# EAGLE schematic Pendeluhr (EAGLE 5.06)
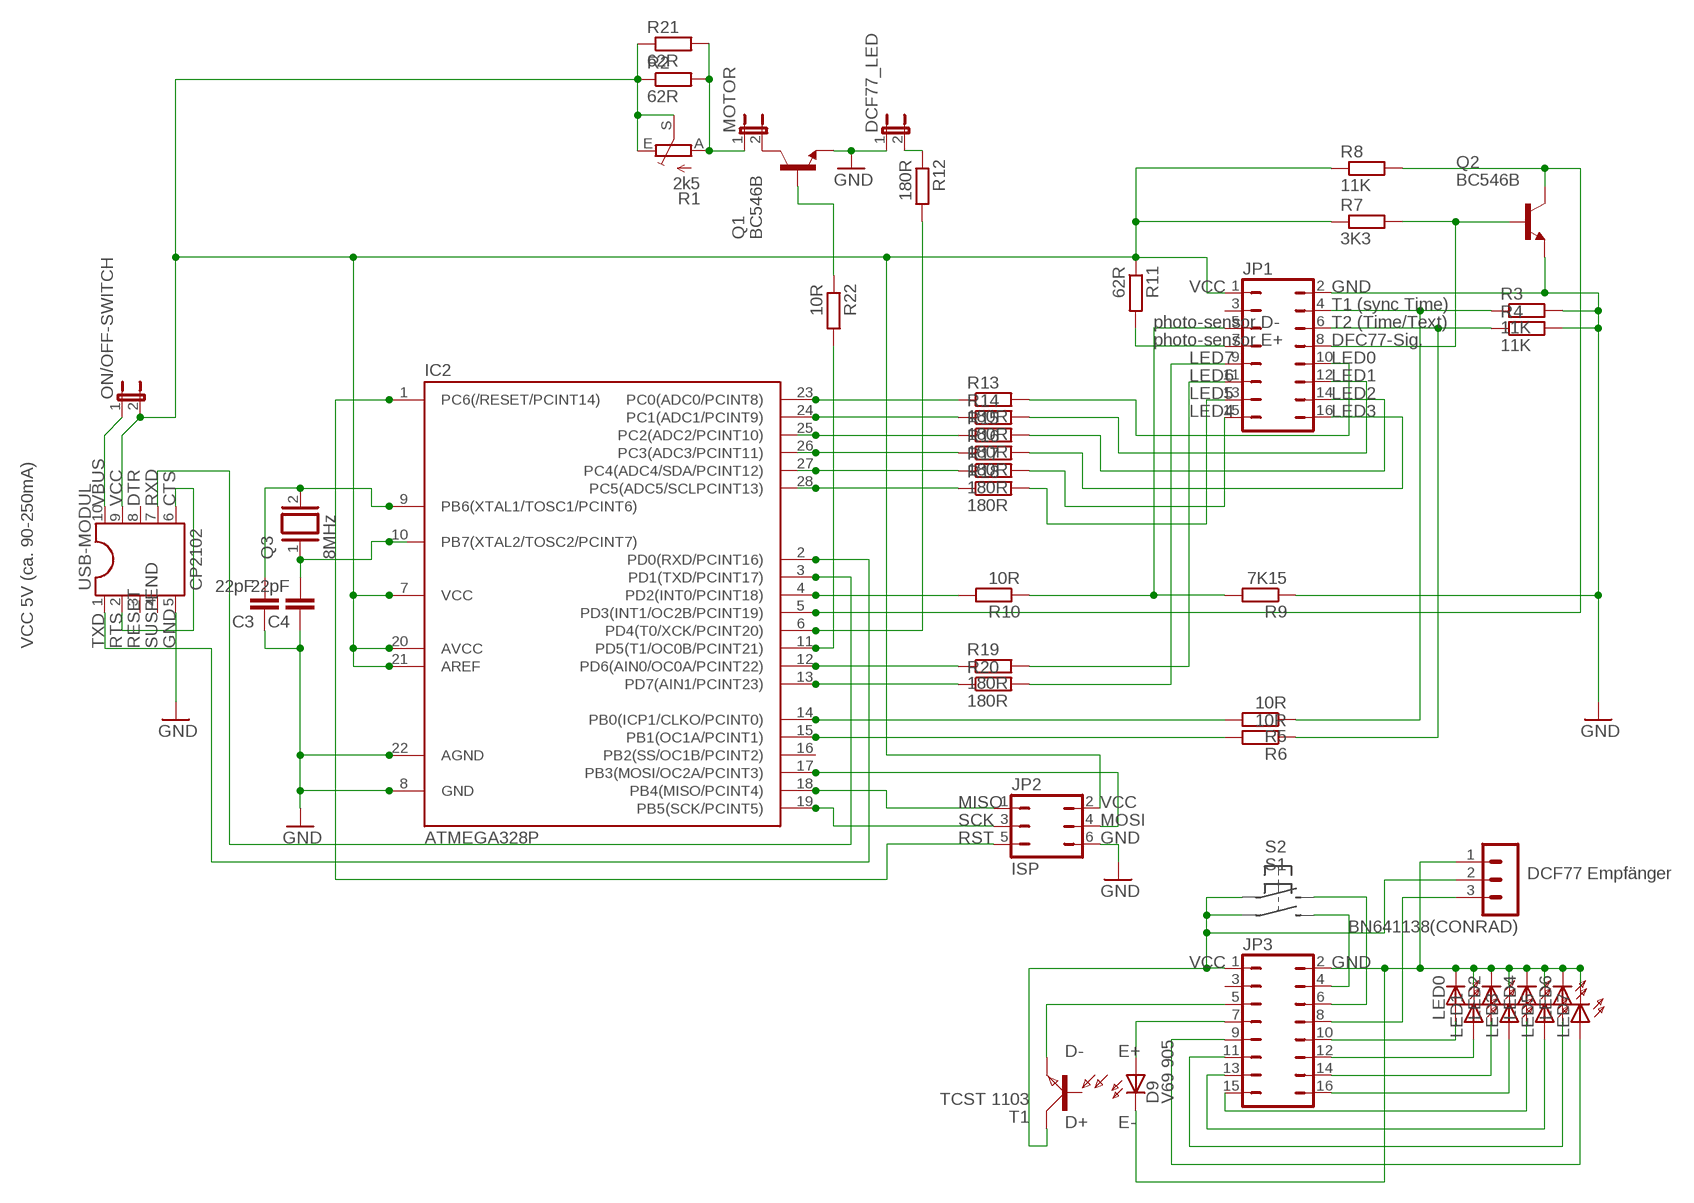
[diagram p0: schematic, sheet 1]

## Parts
BN641138(CONRAD)  MA03-1  [MA03-1]
C3  22pF  C-EU025-024X044  [C025-024X044]
C4  22pF  C-EU025-024X044  [C025-024X044]
D9  V69 905  HLMP6  [HLMP6]
DCF77_LED  JP1E  [JP1]
IC2  ATMEGA328P  MEGA48/88/168-PU  [DIL28-3]
JP1  JP8Q  [JP8Q]
JP2  ISP  JP3Q  [JP3Q]
JP3  JP8Q  [JP8Q]
LED0  HLMP6  [HLMP6]
LED1  HLMP6  [HLMP6]
LED2  HLMP6  [HLMP6]
LED3  HLMP6  [HLMP6]
LED4  HLMP6  [HLMP6]
LED5  HLMP6  [HLMP6]
LED6  HLMP6  [HLMP6]
LED7  HLMP6  [HLMP6]
MOTOR  JP1E  [JP1]
ON/OFF-SWITCH  JP1E  [JP1]
Q1  BC546B  [TO92-EBC]
Q2  BC546B  [TO92-EBC]
Q3  8MHz  XTAL/S  [QS]
R1  2k5  TRIM_EU-CA9V  [CA9V]
R2  62R  R-EU_0207/10  [0207/10]
R3  11K  R-EU_0207/10  [0207/10]
R4  11K  R-EU_0207/10  [0207/10]
R5  10R  R-EU_0207/10  [0207/10]
R6  10R  R-EU_0207/10  [0207/10]
R7  3K3  R-EU_0207/10  [0207/10]
R8  11K  R-EU_0207/10  [0207/10]
R9  7K15  R-EU_0207/10  [0207/10]
R10  10R  R-EU_0207/10  [0207/10]
R11  62R  R-EU_0207/10  [0207/10]
R12  180R  R-EU_0207/10  [0207/10]
R13  180R  R-EU_0207/10  [0207/10]
R14  180R  R-EU_0207/10  [0207/10]
R15  180R  R-EU_0207/10  [0207/10]
R16  180R  R-EU_0207/10  [0207/10]
R17  180R  R-EU_0207/10  [0207/10]
R18  180R  R-EU_0207/10  [0207/10]
R19  180R  R-EU_0207/10  [0207/10]
R20  180R  R-EU_0207/10  [0207/10]
R21  62R  R-EU_0207/10  [0207/10]
R22  10R  R-EU_0207/10  [0207/10]
T1  TCST 1103  BP103  [BP103]
USB-MODUL  CP2102  DIL10  [DIL10]

## Nets
GND: C3.1 C4.1 DCF77_LED.1 IC2.8(GND) IC2.22(AGND) JP1.2 JP2.6 Q1.E Q2.E R3.2 R4.2 R9.1 USB-MODUL.5
N$1: USB-MODUL.2 USB-MODUL.6
N$2: IC2.2(PD0(RXD/PCINT16)) USB-MODUL.1
N$3: IC2.3(PD1(TXD/PCINT17)) USB-MODUL.7
N$4: ON/OFF-SWITCH.1 USB-MODUL.10
N$5: IC2.11(PD5(T1/OC0B/PCINT21)) R22.2
N$6: JP3.10 LED0.A
N$7: IC2.7(VCC) IC2.20(AVCC) IC2.21(AREF) JP1.1 JP2.2 ON/OFF-SWITCH.2 R1.E R1.S R2.1 R7.1 R8.1 R11.1 R21.1 USB-MODUL.9
N$8: MOTOR.2 Q1.C
N$9: MOTOR.1 R1.A R2.2 R21.2
N$10: Q1.B R22.1
N$11: JP1.5 R9.2 R10.1
N$12: JP1.6 R4.1 R6.1
N$13: IC2.14(PB0(ICP1/CLKO/PCINT0)) R5.2
N$14: IC2.15(PB1(OC1A/PCINT1)) R6.2
N$15: JP3.12 LED1.A
N$16: JP1.4 R3.1 R5.1
N$17: JP1.7 R11.2
N$18: JP3.14 LED2.A
N$19: DCF77_LED.2 R12.1
N$20: JP1.8 Q2.B R7.2
N$21: IC2.5(PD3(INT1/OC2B/PCINT19)) Q2.C R8.2
N$22: IC2.6(PD4(T0/XCK/PCINT20)) R12.2
N$23: IC2.23(PC0(ADC0/PCINT8)) R13.1
N$24: IC2.24(PC1(ADC1/PCINT9)) R14.1
N$25: IC2.25(PC2(ADC2/PCINT10)) R15.1
N$26: IC2.26(PC3(ADC3/PCINT11)) R16.1
N$27: IC2.27(PC4(ADC4/SDA/PCINT12)) R17.1
N$28: IC2.28(PC5(ADC5/SCLPCINT13)) R18.1
N$29: IC2.12(PD6(AIN0/OC0A/PCINT22)) R19.1
N$30: IC2.13(PD7(AIN1/PCINT23)) R20.1
N$31: JP1.10 R13.2
N$32: JP1.12 R14.2
N$33: JP1.14 R15.2
N$34: JP1.16 R16.2
N$35: JP1.15 R17.2
N$36: JP1.13 R18.2
N$37: JP1.11 R19.2
N$38: JP1.9 R20.2
N$39: C3.2 IC2.9(PB6(XTAL1/TOSC1/PCINT6)) Q3.2
N$40: C4.2 IC2.10(PB7(XTAL2/TOSC2/PCINT7)) Q3.1
N$41: IC2.18(PB4(MISO/PCINT4)) JP2.1
N$42: IC2.19(PB5(SCK/PCINT5)) JP2.3
N$43: IC2.1(PC6(/RESET/PCINT14)) JP2.5
N$44: IC2.17(PB3(MOSI/OC2A/PCINT3)) JP2.4
N$45: IC2.4(PD2(INT0/PCINT18)) R10.2
N$46: JP3.16 LED3.A
N$47: JP3.15 LED4.A
N$48: JP3.13 LED5.A
N$49: JP3.11 LED6.A
N$50: JP3.9 LED7.A
N$51: BN641138(CONRAD).1 D9.K JP3.2 LED0.K LED1.K LED2.K LED3.K LED4.K LED5.K LED6.K LED7.K
N$52: JP3.4
N$53: JP3.6
N$54: BN641138(CONRAD).2 JP3.1 T1.C
N$55: BN641138(CONRAD).3 JP3.8
N$56: JP3.5 T1.E
N$57: D9.A JP3.7
Unconnected: IC2.16(PB2(SS/OC1B/PCINT2)) JP1.3 JP3.3 T1.B USB-MODUL.3 USB-MODUL.4 USB-MODUL.8

## Notes on the sheet
- VCC | GND
- T1 (sync Time)
- photo-sensor D- | T2 (Time/Text)
- photo-sensor E+ | DFC77-Sig.
- LED7 | LED0
- LED6 | LED1
- LED5 | LED2
- LED4 | LED3
- VBUS | VCC | DTR | RXD | CTS
- VCC 5V (ca. 90-250mA) | TXD | RTS | RESET | SUSPEND | GND
- MISO | VCC
- SCK | MOSI
- RST | GND
- DCF77 Empfänger
- VCC | GND
- D- | E+
- D+ | E-

## Library data of the parts
BN641138(CONRAD) = con-lstb:MA03-1: PIN HEADER
C3 C4 = rcl:C-EU: CAPACITOR, European symbol
D9 LED0 LED1-LED7 = display-hp:HLMP6: LED 2mm horizontal
DCF77_LED MOTOR ON/OFF-SWITCH = jumper:JP1E: JUMPER
IC2 = avr-5-4.16:MEGA48/88/168-PU
JP1 JP3 = jumper:JP8Q: JUMPER
JP2 = jumper:JP3Q: JUMPER
Q1 Q2 = transistor-npn:BC546*: NPN Transistor
Q3 = special:XTAL/S: CRYSTAL
R1 = pot:TRIM_EU-: POTENTIOMETER
R2-R22 = rcl:R-EU_: RESISTOR, European symbol
T1 = opto-trans-siemens:BP103: PHOTO TRANSISTOR
USB-MODUL = ic-package:DIL10: Dual In Line / Socket